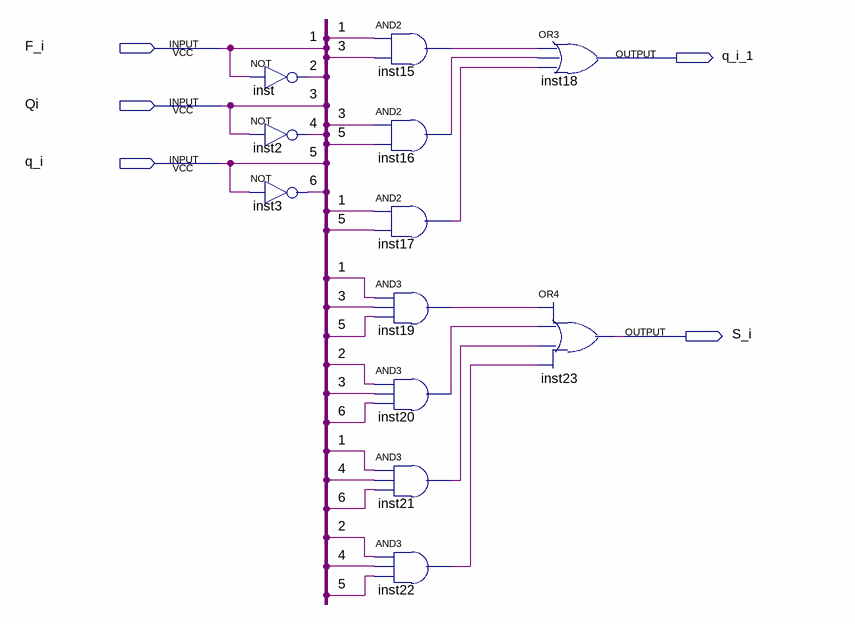
[diagram p0: schematic sheet]
// Quartus schematic SM.bdf as structural Verilog: 12 symbols, 5 pins
module SM (
  input  F_i,
  input  Qi,
  input  q_i,
  output q_i_1,
  output S_i
);

  wire \2 , \4 , \6 , inst15_out, inst16_out, inst17_out, inst19_out, inst20_out, inst21_out, inst22_out;

  not inst (\2 , F_i);
  not inst2 (\4 , Qi);
  not inst3 (\6 , q_i);
  and inst15 (inst15_out, F_i, Qi);
  and inst16 (inst16_out, Qi, q_i);
  and inst17 (inst17_out, F_i, q_i);
  and inst19 (inst19_out, F_i, Qi, q_i);
  and inst20 (inst20_out, \2 , Qi, \6 );
  and inst21 (inst21_out, F_i, \4 , \6 );
  and inst22 (inst22_out, \2 , \4 , q_i);
  or inst18 (q_i_1, inst15_out, inst16_out, inst17_out);
  or inst23 (S_i, inst19_out, inst20_out, inst21_out, inst22_out);

  // Other names for the same wires on the sheet: 1 = F_i; 5 = q_i; 3 = Qi
endmodule
